# EAGLE schematic AD8620 (EAGLE 6.6.0)
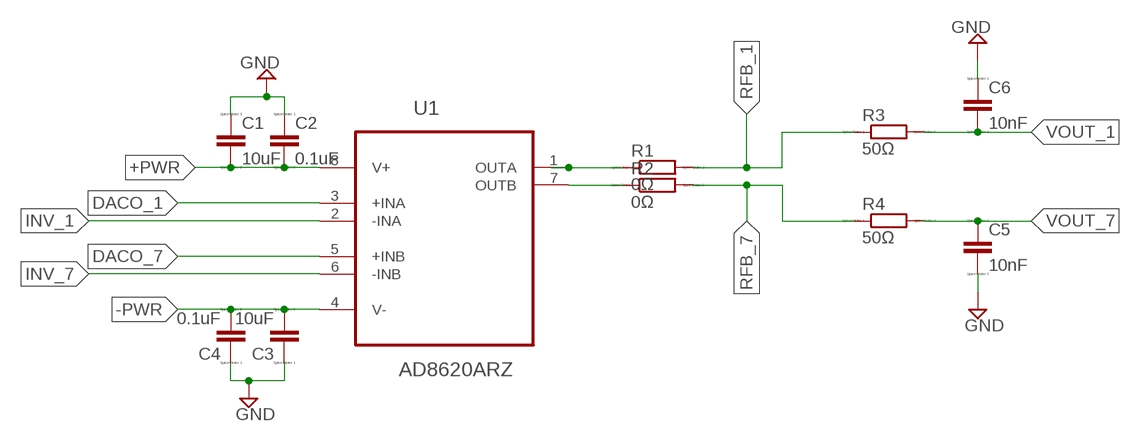
[diagram p0: schematic, sheet 1]

## Parts
C1  10uF  C  [C0805]
C2  0.1uF  CC0603  [C0603]
C3  10uF  C  [C0805]
C4  0.1uF  CC0603  [C0603]
C5  10nF  CC0603  [C0603]
C6  10nF  CC0603  [C0603]
R1  0Ω  RR0603  [R0603]
R2  0Ω  RR0603  [R0603]
R3  50Ω  RR0603  [R0603]
R4  50Ω  RR0603  [R0603]
U1  AD8620ARZ  [SOIC127P600X175-8N]

## Nets
+PWR: C1.2 C2.2 U1.8(V+)
-PWR: C3.2 C4.2 U1.4(V-)
DACO_1: U1.3(+INA)
DACO_7: U1.5(+INB)
GND: C1.1 C2.1 C3.1 C4.1 C5.2 C6.1
INV_1: U1.2(-INA)
INV_7: U1.6(-INB)
N$1: R1.1 U1.1(OUTA)
N$2: R2.1 U1.7(OUTB)
RFB_1: R1.2 R3.1
RFB_7: R2.2 R4.1
VOUT_1: C6.2 R3.2
VOUT_7: C5.1 R4.2

## Library data of the parts
C1-C6 = eagle-ltspice:C: CAPACITOR, European symbol; SPICEMODEL: NONE; SPICEPREFIX: C
R1-R4 = eagle-ltspice:R: RESISTOR, European symbol; SPICEMODEL: NONE; SPICEPREFIX: R
U1 = Analog Devices_By_element14_Batch_1:AD8620ARZ: Precision, Very Low Noise,Low Input Bias Current, Wide Bandwidth JFET Operational Amplifiers; MPN: AD8620ARZ; OC_FARNELL: 9994386; OC_NEWARK: 59K6972; PACKAGE: SOIC-8; SUPPLIER: Analog Devices